# Altium schematic sheet SHIELD1.SchDoc
size A4
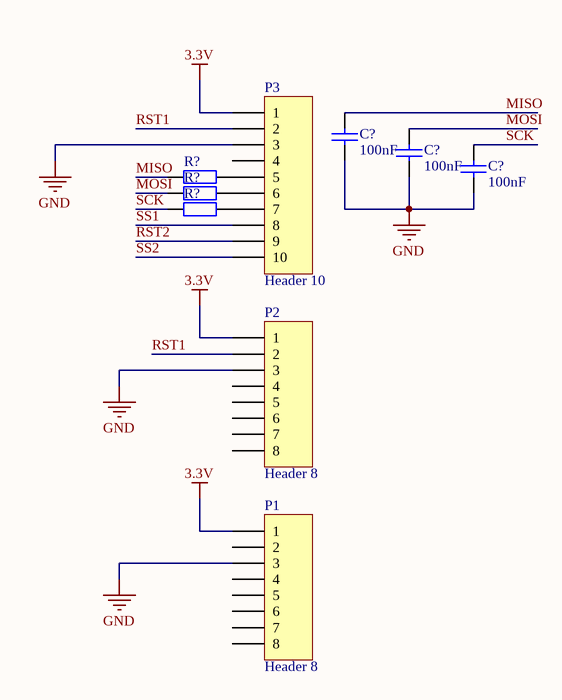
[diagram p0: SHIELD1.SchDoc]

## Parts
(Parts that share a designator on the sheet are numbered #1, #2 ... from top to bottom, then left to right.)
C?#1  value 100nF  [C0805]  (hidden comment: Cap)
C?#2  value 100nF  [C0805]  (hidden comment: Cap)
C?#3  value 100nF  [C0805]  (hidden comment: Cap)
P1  Header 8  [HDR1X8]
P2  Header 8  [HDR1X8]
P3  Header 10  [HDR1X10]
R?#1  Res2  [6-0805_N]  (value not drawn)
R?#2  Res2  [6-0805_N]  (value not drawn)
R?#3  Res2  [6-0805_N]  (value not drawn)

## Nets
3.3V: P1.1 P2.1 P3.1
GND: C?#1.1 C?#2.2 C?#3.2 P1.3 P2.3 P3.3
MISO: C?#1.2 R?#1.1
MOSI: C?#2.1 R?#2.1
RST1: P2.2 P3.2
RST2: P3.9
SCK: C?#3.1 R?#3.1
SS1: P3.8
SS2: P3.10
NetP3_5: P3.5 R?#1.2
NetP3_6: P3.6 R?#2.2
NetP3_7: P3.7 R?#3.2

Not connected (* = marked no-connect by the designer): P1 2 4 5 6 7 8; P2 4 5 6 7 8; P3 4

## Library data of the parts
C?#1-C?#3 = Cap: Capacitor; Published: 8-Jun-2000; LatestRevisionDate: 17-Jul-2002; LatestRevisionNote: Re-released for DXP Platform.; PackageReference: RAD-0.3; Publisher: Altium Limited; PackageDescription: Radial Cap, Thru-Hole; 2 Leads; 0.3 in Pin Spacing
P1 P2 = Header 8: Header, 8-Pin; LatestRevisionDate: 17-Jul-2002; LatestRevisionNote: Re-released for DXP Platform.; Publisher: Altium Limited
P3 = Header 10: Header, 10-Pin; LatestRevisionDate: 17-Jul-2002; LatestRevisionNote: Re-released for DXP Platform.; Publisher: Altium Limited
R?#1-R?#3 = Res2: Resistor; Value: 1K; Published: 8-Jun-2000; LatestRevisionDate: 17-Jul-2002; LatestRevisionNote: Re-released for DXP Platform.; PackageReference: AXIAL-0.4; Publisher: Altium Limited; PackageDescription: Axial Device, Thru-Hole; 2 Leads; 0.4 in Pin Spacing